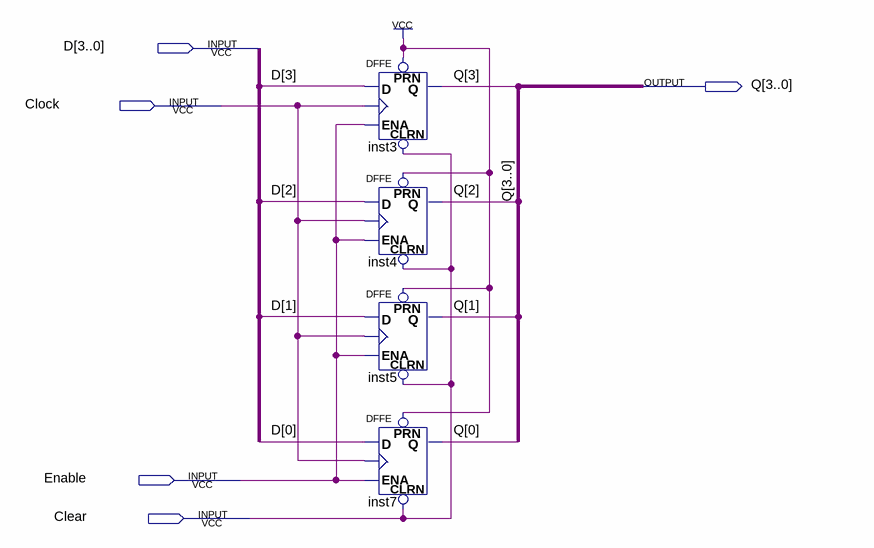
[diagram p0: schematic sheet]
// Quartus schematic inst8.bdf as structural Verilog: 4 symbols, 5 pins
module inst8 (
  input  [3:0] D,
  input  Clock,
  input  Enable,
  input  Clear,
  output [3:0] Q
);

  DFFE inst3 (.PRN(1'b1), .CLRN(Clear), .D(D[3]), .CLK(Clock), .ENA(Enable), .Q(Q[3]));
  DFFE inst4 (.PRN(1'b1), .CLRN(Clear), .D(D[2]), .CLK(Clock), .ENA(Enable), .Q(Q[2]));
  DFFE inst5 (.PRN(1'b1), .CLRN(Clear), .D(D[1]), .CLK(Clock), .ENA(Enable), .Q(Q[1]));
  DFFE inst7 (.PRN(1'b1), .CLRN(Clear), .D(D[0]), .CLK(Clock), .ENA(Enable), .Q(Q[0]));
endmodule
